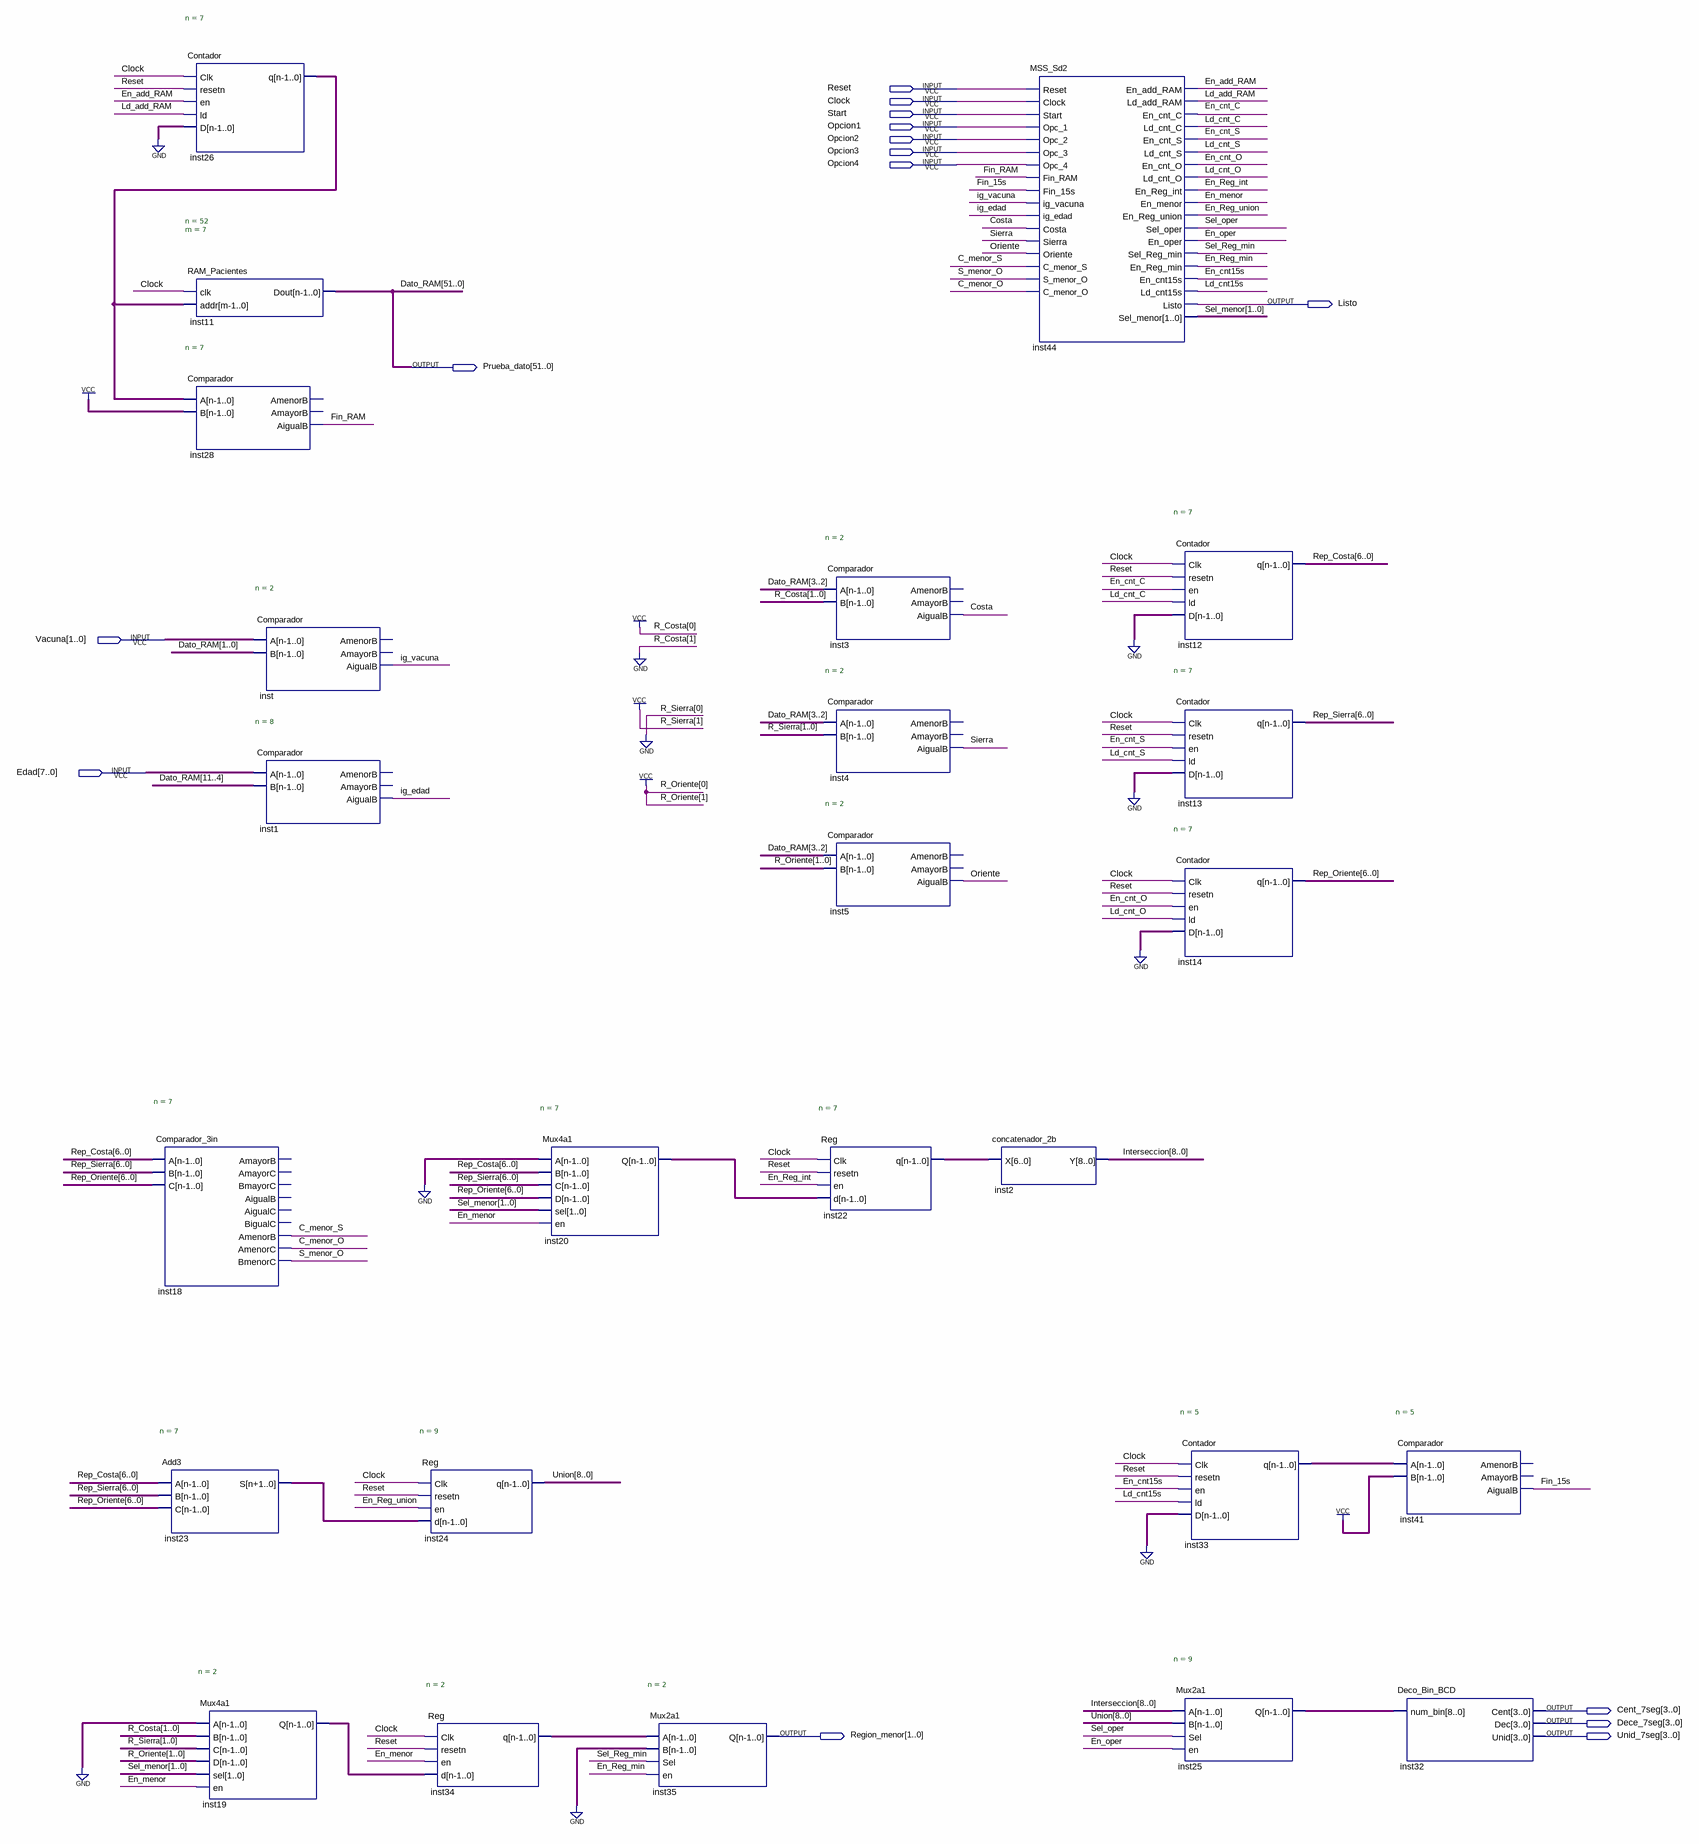
[diagram p0: schematic sheet]
// Quartus schematic ParticionFunc.bdf as structural Verilog: 25 symbols, 15 pins
module ParticionFunc (
  input  Reset,
  input  Clock,
  input  Start,
  input  Opcion1,
  input  Opcion2,
  input  Opcion3,
  input  Opcion4,
  input  [1:0] Vacuna,
  input  [7:0] Edad,
  output Listo,
  output [51:0] Prueba_dato,
  output [3:0] Cent_7seg,
  output [3:0] Dece_7seg,
  output [1:0] Region_menor,
  output [3:0] Unid_7seg
);

  wire C_menor_O, C_menor_S, Costa, En_add_RAM, En_cnt15s, En_cnt_C, En_cnt_O, En_cnt_S, En_menor, En_oper,
       En_Reg_int, En_Reg_min, En_Reg_union, Fin_15s, Fin_RAM, ig_edad, ig_vacuna, Ld_add_RAM, Ld_cnt15s,
       Ld_cnt_C, Ld_cnt_O, Ld_cnt_S, Oriente, S_menor_O, Sel_oper, Sel_Reg_min, Sierra;
  wire [1:0] inst19_q, inst34_q, Sel_menor;
  wire [4:0] inst33_q;
  wire [6:0] inst20_q, inst22_q, inst26_q, Rep_Costa, Rep_Oriente, Rep_Sierra;
  wire [8:0] inst23_s, inst25_q, Interseccion, Union;

  Contador #(.n(7)) inst26 (.Clk(Clock), .resetn(Reset), .en(En_add_RAM), .ld(Ld_add_RAM), .D({7{1'b0}}), .q(inst26_q));
  RAM_Pacientes #(.n(52), .m(7)) inst11 (.clk(Clock), .addr(inst26_q), .Dout(Prueba_dato));
  Comparador #(.n(7)) inst28 (.A(inst26_q), .B({7{1'b1}}), .AigualB(Fin_RAM));  // open: AmenorB, AmayorB
  Comparador_3in #(.n(7)) inst18 (
    .A(Rep_Costa), .B(Rep_Sierra), .C(Rep_Oriente), .AmenorB(C_menor_S), .AmenorC(C_menor_O),
    .BmenorC(S_menor_O));  // open: AmayorB, AmayorC, BmayorC, AigualB, AigualC, BigualC
  Add3 #(.n(7)) inst23 (.A(Rep_Costa), .B(Rep_Sierra), .C(Rep_Oriente), .S(inst23_s));
  Mux4a1 #(.n(2)) inst19 (.A(2'b00), .B(2'b01), .C(2'b10), .D(2'b11), .sel(Sel_menor), .en(En_menor), .Q(inst19_q));
  Comparador #(.n(2)) inst (.A(Vacuna), .B(Prueba_dato[1:0]), .AigualB(ig_vacuna));  // open: AmenorB, AmayorB
  Comparador #(.n(8)) inst1 (.A(Edad), .B(Prueba_dato[11:4]), .AigualB(ig_edad));  // open: AmenorB, AmayorB
  Reg #(.n(9)) inst24 (.Clk(Clock), .resetn(Reset), .en(En_Reg_union), .d(inst23_s), .q(Union));
  Reg #(.n(2)) inst34 (.Clk(Clock), .resetn(Reset), .en(En_menor), .d(inst19_q), .q(inst34_q));
  Mux4a1 #(.n(7)) inst20 (
    .A({7{1'b0}}), .B(Rep_Costa), .C(Rep_Sierra), .D(Rep_Oriente), .sel(Sel_menor), .en(En_menor),
    .Q(inst20_q));
  Mux2a1 #(.n(2)) inst35 (.A(inst34_q), .B(2'b00), .Sel(Sel_Reg_min), .en(En_Reg_min), .Q(Region_menor));
  Comparador #(.n(2)) inst3 (.A(Prueba_dato[3:2]), .B(2'b01), .AigualB(Costa));  // open: AmenorB, AmayorB
  Comparador #(.n(2)) inst4 (.A(Prueba_dato[3:2]), .B(2'b10), .AigualB(Sierra));  // open: AmenorB, AmayorB
  Comparador #(.n(2)) inst5 (.A(Prueba_dato[3:2]), .B(2'b11), .AigualB(Oriente));  // open: AmenorB, AmayorB
  Reg #(.n(7)) inst22 (.Clk(Clock), .resetn(Reset), .en(En_Reg_int), .d(inst20_q), .q(inst22_q));
  concatenador_2b inst2 (.X(inst22_q), .Y(Interseccion));
  MSS_Sd2 inst44 (
    .Reset(Reset), .Clock(Clock), .Start(Start), .Opc_1(Opcion1), .Opc_2(Opcion2), .Opc_3(Opcion3),
    .Opc_4(Opcion4), .Fin_RAM(Fin_RAM), .Fin_15s(Fin_15s), .ig_vacuna(ig_vacuna), .ig_edad(ig_edad),
    .Costa(Costa), .Sierra(Sierra), .Oriente(Oriente), .C_menor_S(C_menor_S), .S_menor_O(S_menor_O),
    .C_menor_O(C_menor_O), .En_add_RAM(En_add_RAM), .Ld_add_RAM(Ld_add_RAM), .En_cnt_C(En_cnt_C),
    .Ld_cnt_C(Ld_cnt_C), .En_cnt_S(En_cnt_S), .Ld_cnt_S(Ld_cnt_S), .En_cnt_O(En_cnt_O), .Ld_cnt_O(Ld_cnt_O),
    .En_Reg_int(En_Reg_int), .En_menor(En_menor), .En_Reg_union(En_Reg_union), .Sel_oper(Sel_oper),
    .En_oper(En_oper), .Sel_Reg_min(Sel_Reg_min), .En_Reg_min(En_Reg_min), .En_cnt15s(En_cnt15s),
    .Ld_cnt15s(Ld_cnt15s), .Listo(Listo), .Sel_menor(Sel_menor));
  Contador #(.n(7)) inst12 (.Clk(Clock), .resetn(Reset), .en(En_cnt_C), .ld(Ld_cnt_C), .D({7{1'b0}}), .q(Rep_Costa));
  Contador #(.n(7)) inst13 (.Clk(Clock), .resetn(Reset), .en(En_cnt_S), .ld(Ld_cnt_S), .D({7{1'b0}}), .q(Rep_Sierra));
  Contador #(.n(7)) inst14 (.Clk(Clock), .resetn(Reset), .en(En_cnt_O), .ld(Ld_cnt_O), .D({7{1'b0}}), .q(Rep_Oriente));
  Contador #(.n(5)) inst33 (.Clk(Clock), .resetn(Reset), .en(En_cnt15s), .ld(Ld_cnt15s), .D({5{1'b0}}), .q(inst33_q));
  Mux2a1 #(.n(9)) inst25 (.A(Interseccion), .B(Union), .Sel(Sel_oper), .en(En_oper), .Q(inst25_q));
  Comparador #(.n(5)) inst41 (.A(inst33_q), .B({5{1'b1}}), .AigualB(Fin_15s));  // open: AmenorB, AmayorB
  Deco_Bin_BCD inst32 (.num_bin(inst25_q), .Cent(Cent_7seg), .Dec(Dece_7seg), .Unid(Unid_7seg));

  // Other names for the same wires on the sheet: Dato_RAM[51:0] = Prueba_dato
endmodule
